# EAGLE design squall-breakout (EAGLE 6.5.0)
AUTHOR: Brad Campbell; REV: A; TITLE: Squall Breakout
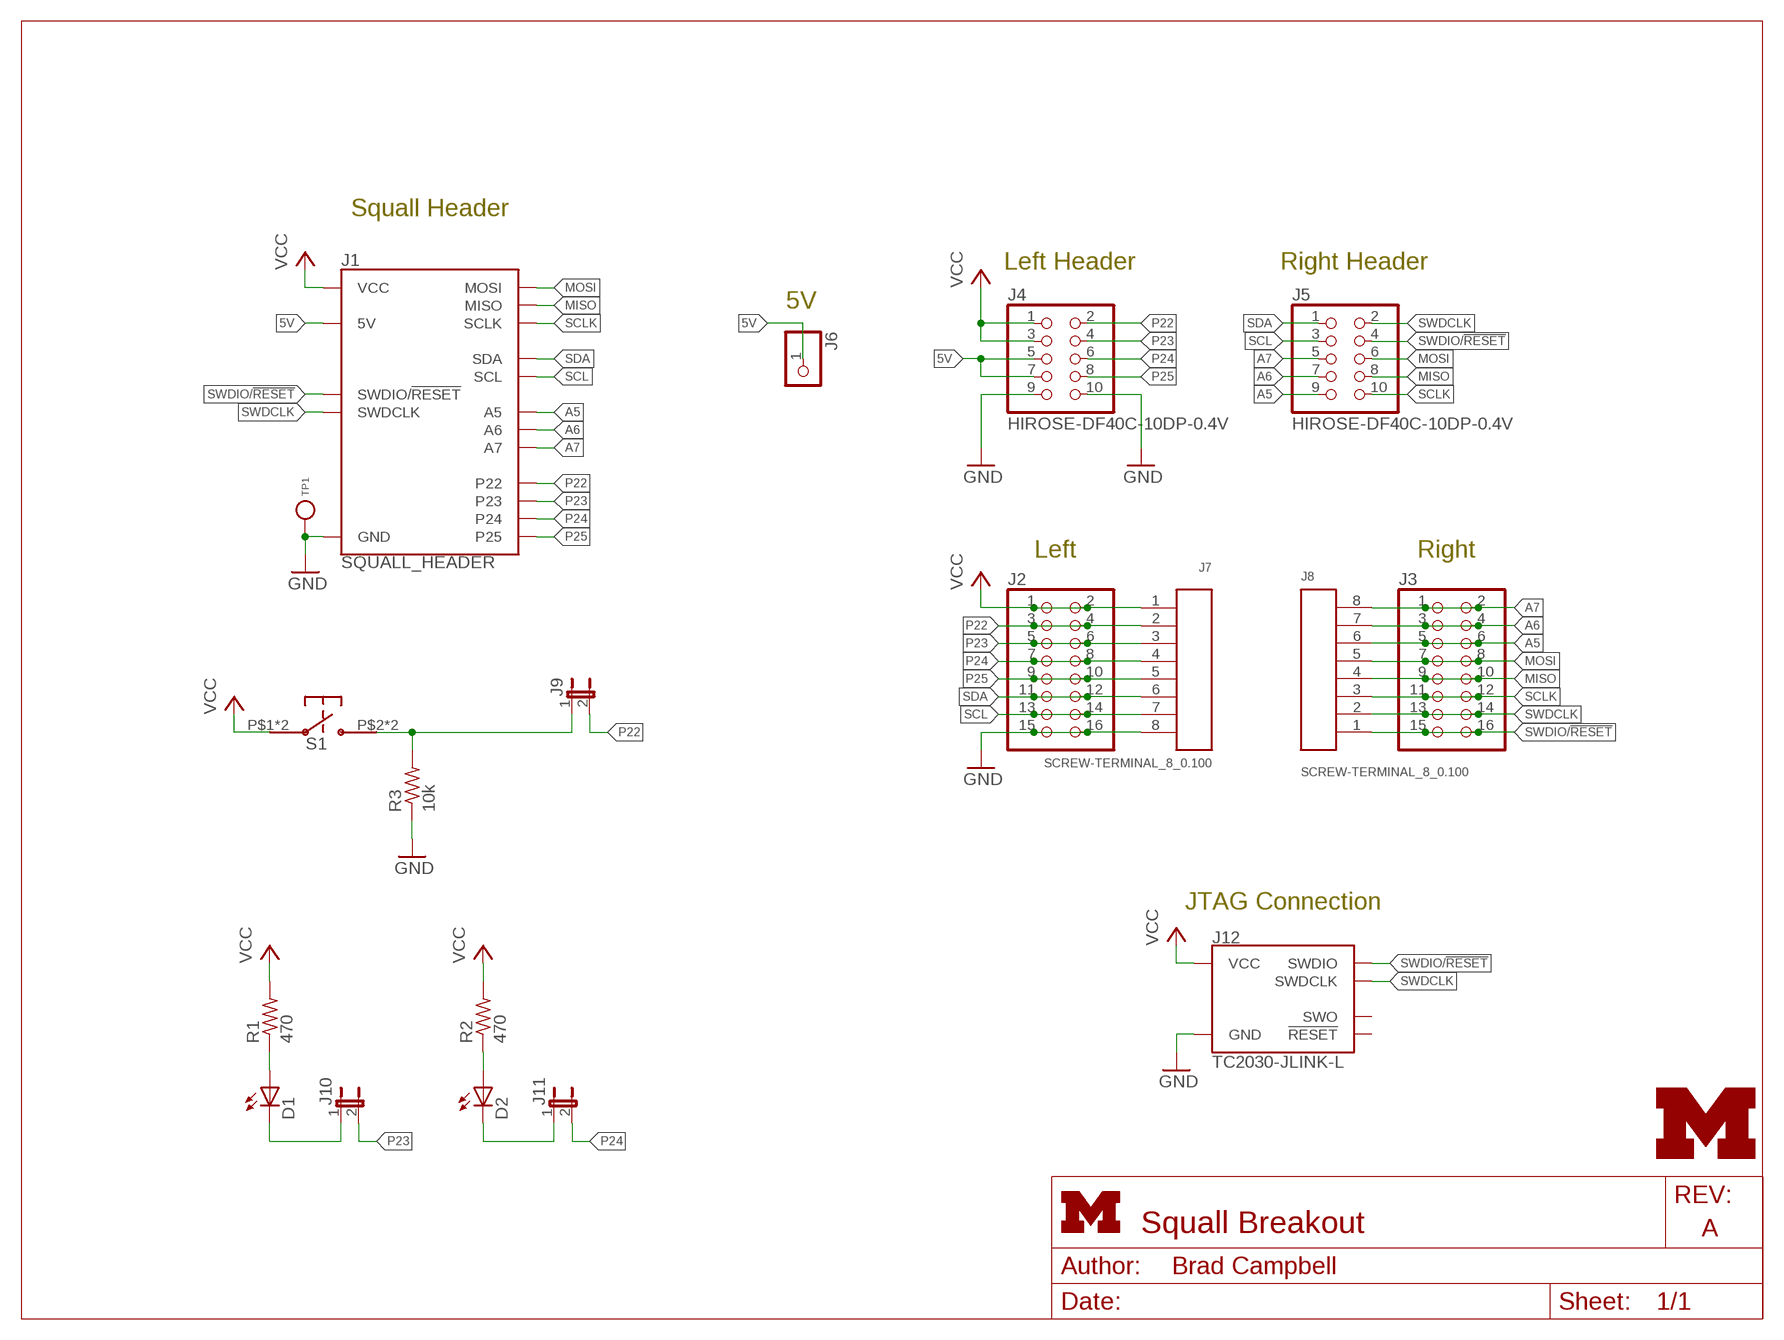
[diagram p0: schematic, sheet 1]
FRAME1 (LETTER_L): HEIGHT: 8.5in; WIDTH: 11in

## Parts
D1  LED0603  [LED-0603]
D2  LED0603  [LED-0603]
J1  SQUALL_HEADER  [SQUALL_HEADER]
J2  PINHD-2X8  [2X08]
J3  PINHD-2X8  [2X08]
J4  HIROSE-DF40C-10DP-0.4V  [2X5/SMD/0.4MM]
J5  HIROSE-DF40C-10DP-0.4V  [2X5/SMD/0.4MM]
J6  PINHD-1X1  [1X01]
J7  SCREW-TERMINAL_8_0.100  [CONN_BLOCK_8]
J8  SCREW-TERMINAL_8_0.100  [CONN_BLOCK_8]
J9  JUMPER-2PTH  [1X02]
J10  JUMPER-2PTH  [1X02]
J11  JUMPER-2PTH  [1X02]
J12  TC2030-JLINK-L  [TC2030-IDC]
LOGO1  UMICH_SOLID_TINY  [UMICH_SOLID_50MIL]
R1  470  R-US_R0603  [R0603]
R2  470  R-US_R0603  [R0603]
R3  10k  R-US_R0603  [R0603]
S1  EVQP2  [EVQP2]
TP1  TEST_POINT_0.112IN  [TESTPOINT_0.112IN]

## Nets
5V: J1.A5(5V) J1.A7(5V) J4.5 J4.7 J6.1
A5: J1.B9(A5) J3.5 J3.6 J5.9 J8.6
A6: J1.B7(A6) J3.3 J3.4 J5.7 J8.7
A7: J1.B5(A7) J3.1 J3.2 J5.5 J8.8
GND: J1.A9(GND) J1.A10(GND) J2.15 J2.16 J4.9 J4.10 J7.8 J12.5(GND) R3.1 TP1.1(TESTPOINT)
MISO: J1.B8(MISO) J3.9 J3.10 J5.8 J8.4
MOSI: J1.B6(MOSI) J3.7 J3.8 J5.6 J8.5
N$1: J9.1 R3.2 S1.P$2 S1.P$4
N$2: D1.A R1.1
N$3: D1.C J10.1
N$4: D2.A R2.1
N$5: D2.C J11.1
P22: J1.A2(P22) J2.3 J2.4 J4.2 J7.2 J9.2
P23: J1.A4(P23) J2.5 J2.6 J4.4 J7.3 J10.2
P24: J1.A6(P24) J2.7 J2.8 J4.6 J7.4 J11.2
P25: J1.A8(P25) J2.9 J2.10 J4.8 J7.5
SCL: J1.B3(SCL) J2.13 J2.14 J5.3 J7.7
SCLK: J1.B10(SCLK) J3.11 J3.12 J5.10 J8.3
SDA: J1.B1(SDA) J2.11 J2.12 J5.1 J7.6
SWDCLK: J1.B2(SWDCLK) J3.13 J3.14 J5.2 J8.2 J12.4(SWDCLK)
SWDIO/!RESET: J1.B4(SWDIO/!RESET) J3.15 J3.16 J5.4 J8.1 J12.2(SWDIO)
VCC: J1.A1(VCC) J1.A3(VCC) J2.1 J2.2 J4.1 J4.3 J7.1 J12.1(VCC) R1.2 R2.2 S1.P$1 S1.P$3
Unconnected: J12.3(!RESET) J12.6(SWO)

## Notes on the sheet
- Squall Header
- Left Header | Right Header
- 5V
- Left | Right
- JTAG Connection

## Library data of the parts
D1 D2 = SparkFun-LED:LED: LEDs Standard schematic elements and footprints for 5mm, 3mm, 1206, and 0603 sized LEDs. 5mm - Spark Fun Electronics SKU : COM-00529 (and others)
J1 = squall:SQUALL_HEADER: Header for a sensor board on top of the Squall BLE tag board. Requires two DF40C-10DS-0.4V(51).; DIGIKEY: H11617CT-ND
J2 J3 = pinhead:PINHD-2X8: PIN HEADER
J4 J5 = headers:HIROSE-DF40C-10DP-0.4V: DF40 Series Header - 0.4MM Pitch; DIGIKEY: H11616CT-ND; MOUSER: 798-DF40C10DP0.4V51; NEWARK: 68X2585
J6 = pinhead:PINHD-1X1: PIN HEADER
J7 J8 = headers:SCREW-TERMINAL_8_0.100: 8x 0.100 in screw terminal block; DIGIKEY: 277-1279-ND; MOUSER: 651-1725711; NEWARK: 71C4111
J9-J11 = SparkFun-Passives:JUMPER-2: Jumper Basic 0.1" spaced jumper. Use with breakaway headers.
J12 = connector:TC2030-JLINK
LOGO1 = logos:UMICH_SOLID
R1-R3 = rcl:R-US_: RESISTOR, American symbol
S1 = switches:EVQP2: SWITCH TACTILE SPST-NO 0.02A 15V; DIGIKEY: P11084SCT-ND
TP1 = headers:TEST_POINT_0.112IN: Solder terminal, turreted; NEWARK: 40F6015

## Board
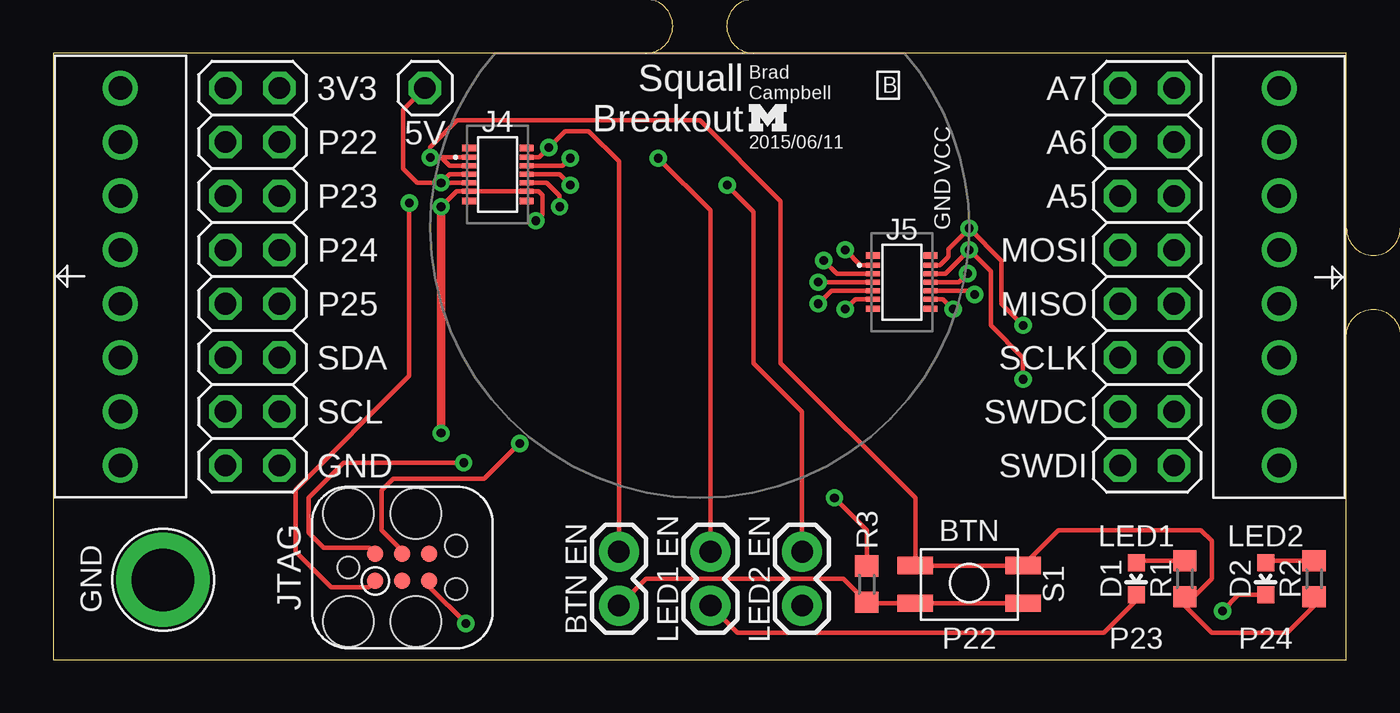
[diagram p1: board, top side]
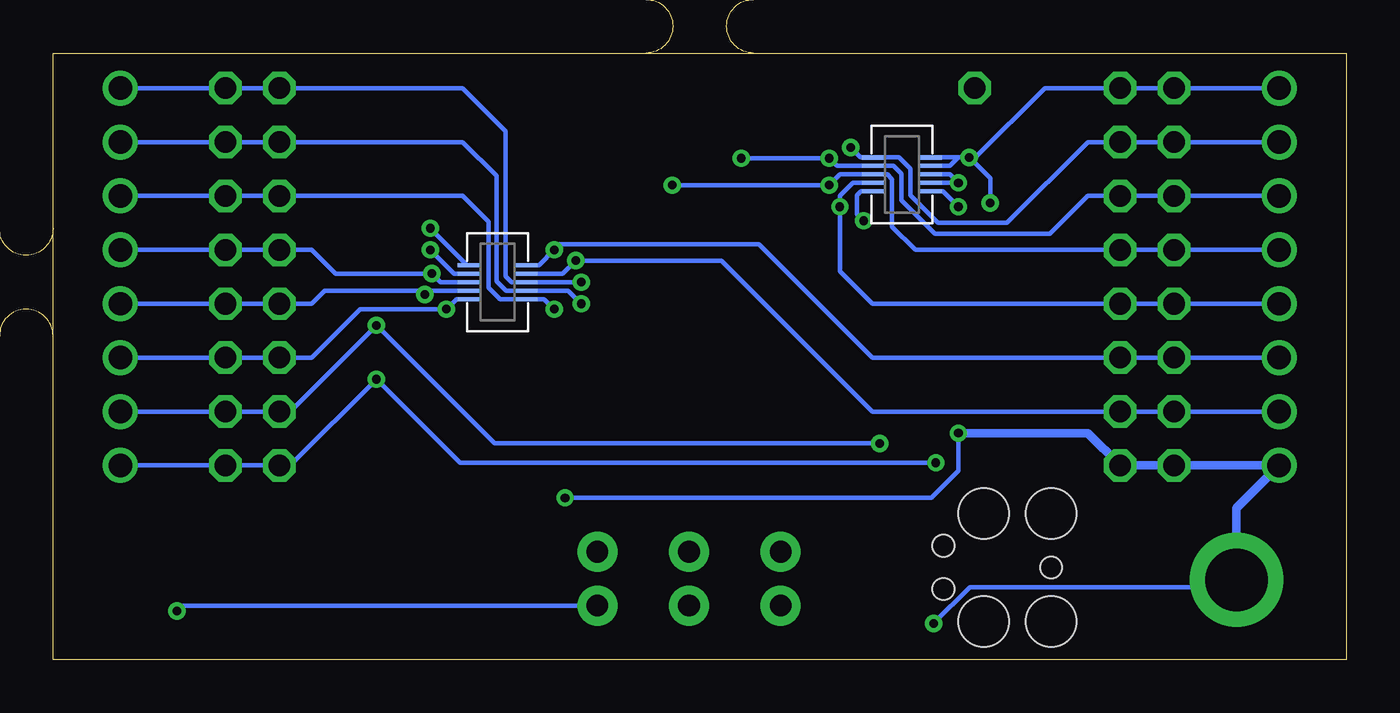
[diagram p2: board, bottom side, seen from below]

Size 60.96 x 28.57 mm. Coordinates in mm from the lower left corner, seen from the top.
Outline: 60.96,0 60.96,28.57 0,28.57 0,0 60.96,0
Copper layers (1*16): Top 0.0178mm / dielectric 59mil / Bottom 0.0178mm
Design rules "sunstone-2lyr_v1.0.0.3": minimum track width 6mil, minimum drill 14mil, track to track 6mil, track to pad 6mil, pad to pad 6mil, via to via 6mil, smd to smd 6mil, copper to edge 20mil, drill to drill 16mil, minimum pad ring 8mil, minimum via ring 8mil, stop-mask expansion 3mil, vias tented up to drill 0mil, thermal gap 10mil
Milling: 10 lines

### Footprints (pad centres in the part's own frame; a part is rotated, then mirrored left to right if it is on the bottom)
LED-0603 = smd 0.8 x 0.8: A 0,-0.75; C 0,0.75
SQUALL_HEADER = smd 1.14 x 0.2 bottom: A1 -10.845,3.34; A2 -8.205,3.34; A3 -10.845,2.94; A4 -8.205,2.94; A5 -10.845,2.54; A6 -8.205,2.54; A7 -10.845,2.14; A8 -8.205,2.14; A9 -10.845,1.74; A10 -8.205,1.74; B1 8.205,-1.74; B2 10.845,-1.74; B3 8.205,-2.14; B4 10.845,-2.14; B5 8.205,-2.54; B6 10.845,-2.54; B7 8.205,-2.94; B8 10.845,-2.94; B9 8.205,-3.34; B10 10.845,-3.34
2X08 = drill 1.016 octagon: 1 -8.89,-1.27; 2 -8.89,1.27; 3 -6.35,-1.27; 4 -6.35,1.27; 5 -3.81,-1.27; 6 -3.81,1.27; 7 -1.27,-1.27; 8 -1.27,1.27; 9 1.27,-1.27; 10 1.27,1.27; 11 3.81,-1.27; 12 3.81,1.27; 13 6.35,-1.27; 14 6.35,1.27; 15 8.89,-1.27; 16 8.89,1.27
2X5/SMD/0.4MM = smd 0.66 x 0.23: 1 -1.355,0.8; 2 1.355,0.8; 3 -1.355,0.4; 4 1.355,0.4; 5 -1.355,0; 6 1.355,0; 7 -1.355,-0.4; 8 1.355,-0.4; 9 -1.355,-0.8; 10 1.355,-0.8 | smd 0.66 x 0.3: A -1.355,1.25; B 1.355,1.25; C -1.355,-1.25; D 1.355,-1.25
1X01 = drill 1.016 octagon: 1 0,0
CONN_BLOCK_8 = drill 1.1: 1 -8.89,0; 2 -6.35,0; 3 -3.81,0; 4 -1.27,0; 5 1.27,0; 6 3.81,0; 7 6.35,0; 8 8.89,0
1X02 = drill 1.016 pad 1.88: 1 0,0; 2 2.54,0
TC2030-IDC = smd 0.787 x 0.787: 1 -1.27,-0.635; 2 -1.27,0.635; 3 0,-0.635; 4 0,0.635; 5 1.27,-0.635; 6 1.27,0.635 | hole 2.375: -2.54,2.54; 0.635,2.54; 0.635,-2.54; -2.54,-2.54 | hole 1.016: -2.54,0; 2.54,1.016; 2.54,-1.016
R0603 = smd 1 x 1.1: 1 -0.85,0; 2 0.85,0
EVQP2 = smd 1.676 x 0.813: P$1 -2.54,-0.87; P$2 -2.54,0.908; P$3 2.54,-0.87; P$4 2.54,0.908
TESTPOINT_0.112IN = drill 2.946: 1 0,0

### Placement (x,y rotation side)
D1  51.05,3.81 180 top
D2  57.15,3.81 180 top
J1  30.48,20.32 0 top
J2  9.4,18.03 270 top
J3  51.56,18.03 270 top
J4  20.95,22.86 0 top
J5  40.01,17.78 0 top
J6  17.53,26.92 0 top
J7  3.17,18.03 270 top
J8  57.78,18.03 90 top
J9  26.67,2.54 90 top
J10  30.99,2.54 90 top
J11  35.31,2.54 90 top
J12  16.46,4.34 0 top
LOGO1  33.68,25.53 0 top
R1  53.34,3.81 270 top
R2  59.44,3.81 270 top
R3  38.35,3.56 270 top
S1  43.18,3.56 180 top
TP1  5.18,3.76 0 top

### Tracks (layer width: path | path; a pad name or v marks a point on that pad's centre or on a via)
5V  (via drill 0.41)
  Top 0.203: J4.7 v18.29,22.46 | v18.29,22.46 17.16,22.46 16.51,23.11 16.51,25.91 J6.1 | J4.5 18.69,22.86 v18.29,22.46
  Bottom 0.203: J1.A7 v18.29,22.46 18.69,22.86 J1.A5
A5  (via drill 0.41)
  Top 0.203: J5.9 37.81,16.98 v37.34,16.51
  Bottom 0.203: v37.34,16.51 37.81,16.98 J1.B9 39.89,16.98 40.44,17.53 40.44,20.62 41.66,21.84 J3.5 J3.6 J8.6
A6  (via drill 0.41)
  Top 0.203: v36.07,16.76 36.68,17.38 J5.7
  Bottom 0.203: v36.07,16.76 36.68,17.38 J1.B7 39.6,17.38 40.06,17.83 40.06,22.78 41.66,24.38 J3.3 J3.4 J8.7
A7  (via drill 0.41)
  Top 0.203: J5.5 v36.07,17.78
  Bottom 0.203: v36.07,17.78 J1.B5 39.34,17.78 39.62,18.06 39.62,24.89 41.66,26.92 J3.1 J3.2 J8.8
GND  (via drill 0.41)
  Top 0.203: v18.29,21.34 19.01,22.06 J4.9 J4.10 22.87,22.06 23.06,21.87 23.06,20.98 v22.76,20.68 | J12.5 17.73,3.43 v19.46,1.7 | R3.1 38.35,6.1 v36.83,7.62
  Top 0.406: v18.29,10.67 v18.29,21.34
  Bottom 0.203: J1.A9 19.01,22.06 v18.29,21.34 | J1.A10 22.87,22.06 23.06,21.87 23.06,20.98 v22.76,20.68 | v19.46,1.7 17.75,3.4 5.54,3.4 TP1.1 | v36.83,7.62 19.56,7.62 18.29,8.89 v18.29,10.67
  Bottom 0.406: v18.29,10.67 12.19,10.67 J2.16 J2.15 J7.8 5.18,7.14 TP1.1
MISO  (via drill 0.41)
  Top 0.203: J5.8 43.25,17.38 v43.43,17.2
  Bottom 0.203: v43.43,17.2 43.25,17.38 J1.B8 48.15,17.38 48.77,16.76 J3.9 J3.10 J8.4
MOSI  (via drill 0.41)
  Top 0.203: J5.6 42.7,17.78 v43.1,18.19
  Bottom 0.203: J1.B6 42.7,17.78 v43.1,18.19 47.65,18.19 48.77,19.3 J3.7 J3.8 J8.5
N$1
  Top 0.203: J9.1 27.94,3.81 37.25,3.81 R3.2 38.41,2.65 S1.P$4 S1.P$2
N$2
  Top 0.203: R1.1 51.15,4.66 D1.A
N$3
  Top 0.203: D1.C 51.05,2.79 49.53,1.27 32.26,1.27 J10.1
N$4
  Top 0.203: R2.1 57.25,4.66 D2.A
N$5  (via drill 0.41)
  Top 0.203: D2.C 55.87,3.06 v55.12,2.29
  Bottom 0.203: v55.12,2.29 54.86,2.54 J11.1
P22  (via drill 0.41)
  Top 0.203: J4.2 22.9,23.66 v23.37,24.13 24.13,24.89 25.25,24.89 26.67,23.47 J9.2
  Bottom 0.203: v23.37,24.13 22.9,23.66 J1.A2 21.09,23.66 20.55,23.11 20.55,21.87 19.25,20.57 16,20.57 12.19,24.38 J2.4 J2.3 J7.2
P23  (via drill 0.41)
  Top 0.203: J4.4 24.02,23.26 v24.38,23.62 | J10.2 30.99,21.16 v28.52,23.62
  Bottom 0.203: J7.3 J2.5 J2.6 12.19,21.84 13.97,20.07 19.41,20.07 20.98,21.64 20.98,22.89 21.36,23.26 J1.A4 24.02,23.26 v24.38,23.62 v28.52,23.62
P24  (via drill 0.41)
  Top 0.203: J4.6 23.88,22.86 v24.38,22.35 | J11.2 35.31,11.68 33.02,13.97 33.02,21.11 v31.77,22.35
  Bottom 0.203: J7.4 J2.7 J2.8 20.32,19.3 21.41,20.4 21.41,22.63 21.64,22.86 J1.A6 23.88,22.86 v24.38,22.35 v31.77,22.35
P25  (via drill 0.41)
  Top 0.203: J4.8 23.26,22.46 23.88,21.84 v23.88,21.34
  Bottom 0.203: J1.A8 23.26,22.46 23.88,21.84 v23.88,21.34 23.88,18.29 22.35,16.76 J2.10 J2.9 J7.5
SCL  (via drill 0.41)
  Top 0.203: v36.32,18.8 36.94,18.18 J5.3
  Bottom 0.203: J1.B3 36.94,18.18 v36.32,18.8 29.46,18.8 22.35,11.68 J2.14 J2.13 J7.7
SCLK  (via drill 0.41)
  Top 0.203: v42.42,16.51 41.95,16.98 J5.10
  Bottom 0.203: J1.B10 41.95,16.98 v42.42,16.51 46.48,16.51 48.77,14.22 J3.11 J3.12 J8.3
SDA  (via drill 0.41)
  Top 0.203: J5.1 38.06,18.58 v37.34,19.3
  Bottom 0.203: J1.B1 38.06,18.58 v37.34,19.3 37.08,19.56 27.69,19.56 22.35,14.22 J2.12 J2.11 J7.6
SWDCLK  (via drill 0.41)
  Top 0.203: v45.72,15.75 44.7,16.76 44.7,18.8 v43.18,20.32 42.19,19.33 42.19,18.97 41.8,18.58 J5.2 | J12.4 16.46,5.13 15.49,6.1 15.49,7.98 16.03,8.51 20.32,8.51 v22,10.19
  Bottom 0.203: J1.B2 41.44,18.58 v43.18,20.32 | v22,10.19 40.16,10.19 v45.72,15.75 49.78,11.68 J3.13 J3.14 J8.2
SWDIO/!RESET  (via drill 0.41)
  Top 0.203: v45.72,13.21 45.72,14.22 44.2,15.75 44.2,18.29 v43.18,19.3 42.06,18.18 J5.4 | J12.2 14.91,5.26 12.75,5.26 12.04,5.97 12.04,7.62 13.69,9.27 v19.36,9.27
  Bottom 0.203: J1.B4 42.06,18.18 v43.18,19.3 | v19.36,9.27 41.78,9.27 v45.72,13.21 49.78,9.14 J3.15 J3.16 J8.1
VCC  (via drill 0.41)
  Top 0.203: J4.1 v17.78,23.66 | J4.3 18.69,23.26 18.29,23.66 v17.78,23.66 | J12.1 14.88,3.4 13.11,3.4 11.43,5.08 11.43,8 16.79,13.36 v16.79,21.51 | R2.2 59.44,2.54 58.17,1.27 54.61,1.27 53.34,2.54 R1.2 53.76,2.96 54.61,3.81 54.61,5.59 54.1,6.1 47.39,6.1 S1.P$1 S1.P$3 40.64,7.62 34.29,13.97 34.29,21.59 30.48,25.4 19.05,25.4 17.78,24.13 v17.78,23.66
  Bottom 0.203: J1.A1 18.29,23.66 | 18.29,23.66 v17.78,23.66 | v17.78,23.66 17.49,23.66 14.22,26.92 J2.2 J2.1 J7.1 | J1.A3 18.69,23.26 18.29,23.66 | v16.79,21.51 16.79,22.67 v17.78,23.66

### Text on the board
tPlace: 3V3 | B | A7 | Brad / Campbell | 5V | Squall / Breakout | P22 | 2015/06/11 | VCC | A6 | P23 | A5 | GND | P24 | MOSI | P25 | MISO | SDA | SCLK | SCL | SWDC | GND | SWDI | BTN | LED1 | LED2 | GND | JTAG | BTN EN | LED1 EN | LED2 EN | P22 | P23 | P24